# Altium schematic sheet Sheet1.SchDoc
size A4; SheetNumber: 1; SheetTotal: 1
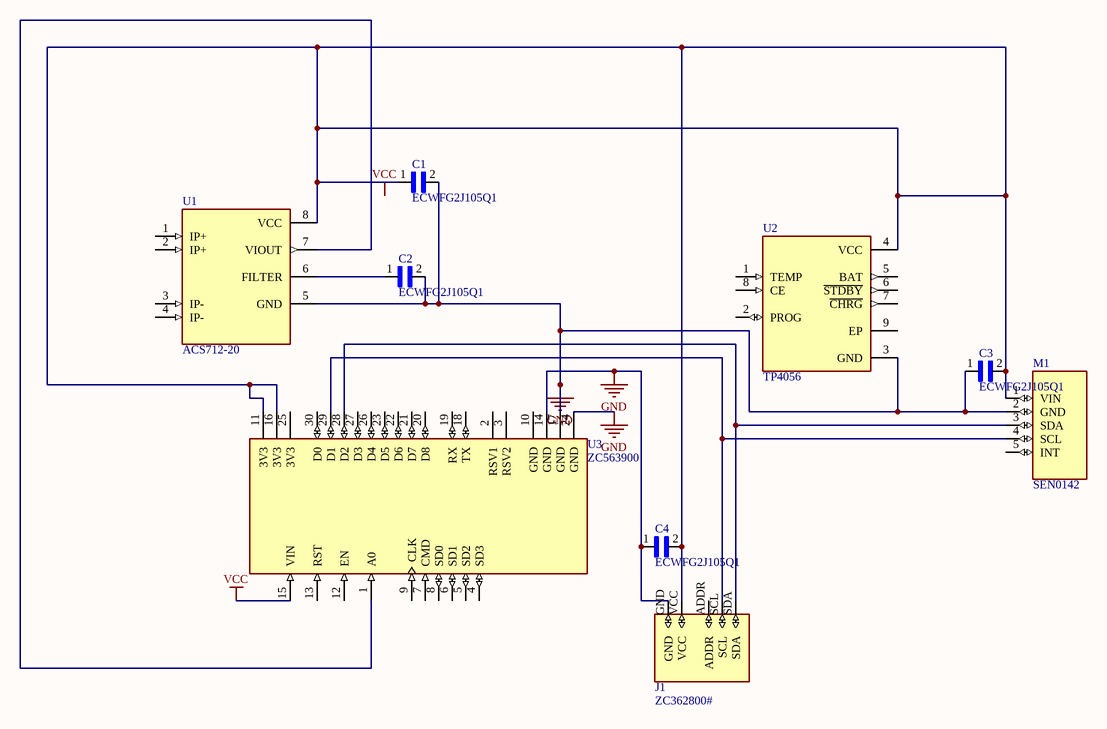
[diagram p0: Sheet1.SchDoc]

## Parts
C1  ECWFG2J105Q1  [CAPRR2250W100L2700T1050H1900]
C2  ECWFG2J105Q1  [CAPRR2250W100L2700T1050H1900]
C3  ECWFG2J105Q1  [CAPRR2250W100L2700T1050H1900]
C4  ECWFG2J105Q1  [CAPRR2250W100L2700T1050H1900]
J1  ZC362800#  [ZC362800#]
M1  SEN0142  [SEN0142]
U1  ACS712-20  [SOIC127P600X175-8N]
U2  TP4056  [SOP127P600X175-9N]
U3  ZC563900  [MODULE_ZC563900]

## Nets
GND: C1.2 C2.2 C3.1 C4.1 J1.GND M1.2(GND) U1.5(GND) U2.3(GND) U3.14(GND) U3.17(GND) U3.24(GND)
VCC: U3.15(VIN)
NetC1_1: C1.1 C3.2 C4.2 J1.VCC M1.1(VIN) U1.8(VCC) U2.4(VCC) U3.11(3V3) U3.16(3V3)
NetC2_1: C2.1 U1.6(FILTER)
NetJ1_SCL: J1.SCL M1.4(SCL) U3.29(D1)
NetJ1_SDA: J1.SDA M1.3(SDA) U3.28(D2)
NetU1_7: U1.7(VIOUT) U3.1(A0)

Not connected (* = marked no-connect by the designer): J1 ADDR; M1 5(INT); U1 1(IP+) 2(IP+) 3(IP-) 4(IP-); U2 1(TEMP) 2(PROG) 5(BAT) 6(~{STDBY}) 7(~{CHRG}) 8(CE) 9(EP); U3 2(RSV1) 3(RSV2) 4(SD3) 5(SD2) 6(SD1) 7(CMD) 8(SD0) 9(CLK) 10(GND) 12(EN) 13(RST) 18(TX) 19(RX) 20(D8) 21(D7) 22(D6) 23(D5) 25(3V3) 26(D4) 27(D3) 30(D0)

## Notes on the sheet
- Labels drawn without touching a wire or pin: VCC

## Library data of the parts
C1-C4 = ECWFG2J105Q1: Metallized Polypropylene Film Capacitor; MF: Panasonic; SnapEDA_Link: https://www.snapeda.com/parts/ECWFG2J105Q1/Panasonic/view-part/?ref=snap; Availability: In Stock; Purchase-URL: https://pricing.snapeda.com/search/part/ECWFG2J105Q1/?ref=eda; MP: ECWFG2J105Q1; Value: *; Price: None; Package: MOLDED-2 Panasonic; Check_prices: https://www.snapeda.com/parts/ECWFG2J105Q1/Panasonic/view-part/?ref=eda
J1 = ZC362800#: 1pc BH1750 Digital Ambient Light Intensity Sensor Module for Arduino GY-302; MF: YKS; SnapEDA_Link: https://www.snapeda.com/parts/ZC362800%23/YKS/view-part/?ref=snap; Package: None; Value: *; MP: ZC362800#; Check_prices: https://www.snapeda.com/parts/ZC362800%23/YKS/view-part/?ref=eda
M1 = SEN0142: MPU-6050 series Accelerometer, Gyroscope, 3 Axis Sensor Evaluation Board; MF: DFRobot; SnapEDA_Link: https://www.snapeda.com/parts/SEN0142/DFRobot/view-part/?ref=snap; Package: None; Value: *; MP: SEN0142; Check_prices: https://www.snapeda.com/parts/SEN0142/DFRobot/view-part/?ref=eda
U1 = ACS712-20: ACS712: Fully Integrated, Hall-Effect-Based Linear Current Sensor IC with 2.1 kV RMS Voltage Isolation and a Low-Resistance Current Conductor; MF: Allegro MicroSystems; SnapEDA_Link: https://www.snapeda.com/parts/ACS712-20/Allegro/view-part/?ref=snap; Package: SOIC-8 Allegro MicroSystems LLC; Value: *; MP: ACS712-20; Check_prices: https://www.snapeda.com/parts/ACS712-20/Allegro/view-part/?ref=eda
U2 = TP4056: MF: others; SnapEDA_Link: https://www.snapeda.com/parts/TP4056/Others/view-part/?ref=snap; Package: None; Value: *; MP: TP4056; Check_prices: https://www.snapeda.com/parts/TP4056/Others/view-part/?ref=eda
U3 = ZC563900: NodeMcu Lua ESP8266 WIFI Internet of Things Network Development Module Board; MF: YKS; SnapEDA_Link: https://www.snapeda.com/parts/ZC563900/YKS/view-part/?ref=snap; Package: None; Value: *; MP: ZC563900; Check_prices: https://www.snapeda.com/parts/ZC563900/YKS/view-part/?ref=eda